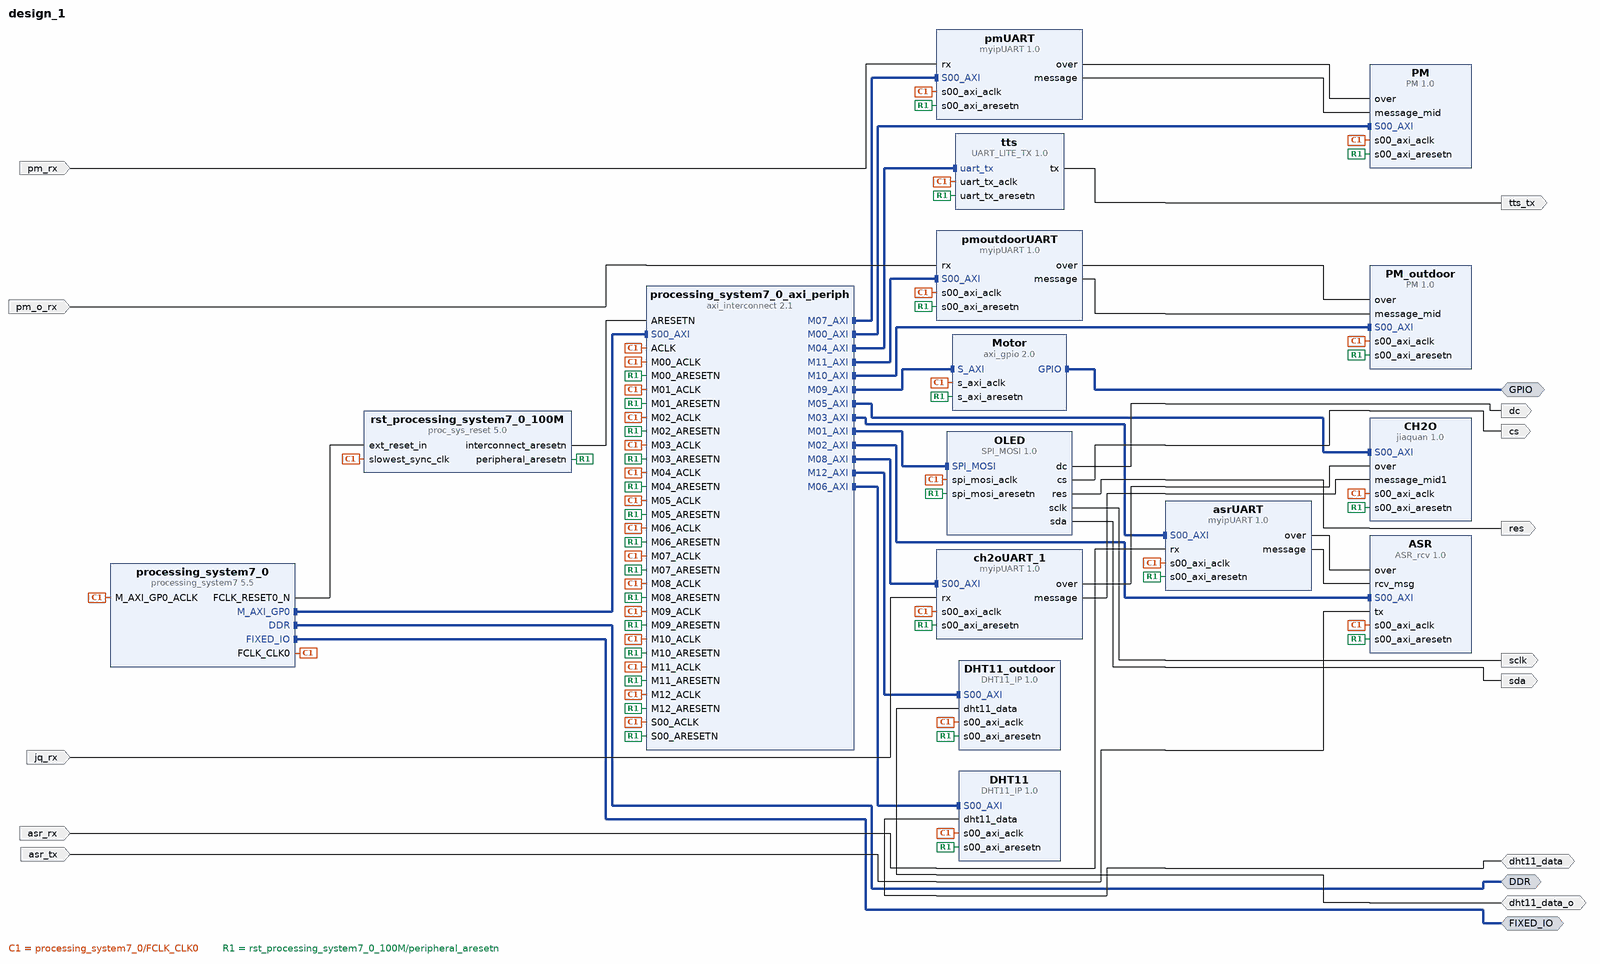
[diagram p0: block diagram of the top level]
# Vivado block design design_1, Vivado 2015.2
create_bd_design design_1

create_bd_intf_port -mode Master -vlnv xilinx.com:interface:ddrx_rtl:1.0 DDR
create_bd_intf_port -mode Master -vlnv xilinx.com:display_processing_system7:fixedio_rtl:1.0 FIXED_IO
create_bd_intf_port -mode Master -vlnv xilinx.com:interface:gpio_rtl:1.0 GPIO
create_bd_port -dir IO dht11_data
create_bd_port -dir I asr_rx
create_bd_port -dir O tts_tx
create_bd_port -dir O dc
create_bd_port -dir O res
create_bd_port -dir O cs
create_bd_port -dir O sclk
create_bd_port -dir O sda
create_bd_port -dir I pm_rx
create_bd_port -dir I jq_rx
create_bd_port -dir I pm_o_rx
create_bd_port -dir IO dht11_data_o
create_bd_port -dir I asr_tx

create_bd_cell -type ip -vlnv xilinx.com:ip:processing_system7:5.5 processing_system7_0
set_property -dict [list \
  CONFIG.PCW_FCLK_CLK0_BUF true \
  CONFIG.PCW_UIPARAM_DDR_FREQ_MHZ 533.333333 \
  CONFIG.PCW_APU_PERIPHERAL_FREQMHZ 666.666666 \
  CONFIG.PCW_SDIO_PERIPHERAL_FREQMHZ 100 \
  CONFIG.PCW_UART_PERIPHERAL_FREQMHZ 100 \
  CONFIG.PCW_FPGA0_PERIPHERAL_FREQMHZ 100 \
  CONFIG.PCW_FPGA1_PERIPHERAL_FREQMHZ 50 \
  CONFIG.PCW_M_AXI_GP0_FREQMHZ 100 \
  CONFIG.PCW_PERIPHERAL_BOARD_PRESET None \
  CONFIG.PCW_PRESET_BANK1_VOLTAGE {LVCMOS 1.8V} \
  CONFIG.PCW_UIPARAM_DDR_PARTNO {MT41K128M16 JT-125} \
  CONFIG.PCW_QSPI_PERIPHERAL_ENABLE 1 \
  CONFIG.PCW_QSPI_QSPI_IO {MIO 1 .. 6} \
  CONFIG.PCW_QSPI_GRP_SINGLE_SS_ENABLE 1 \
  CONFIG.PCW_QSPI_GRP_SINGLE_SS_IO {MIO 1 .. 6} \
  CONFIG.PCW_ENET0_PERIPHERAL_ENABLE 1 \
  CONFIG.PCW_ENET0_ENET0_IO {MIO 16 .. 27} \
  CONFIG.PCW_ENET0_GRP_MDIO_ENABLE 1 \
  CONFIG.PCW_ENET0_GRP_MDIO_IO {MIO 52 .. 53} \
  CONFIG.PCW_ENET_RESET_ENABLE 1 \
  CONFIG.PCW_ENET_RESET_SELECT {Share reset pin} \
  CONFIG.PCW_ENET0_RESET_ENABLE 0 \
  CONFIG.PCW_SD0_PERIPHERAL_ENABLE 1 \
  CONFIG.PCW_SD0_SD0_IO {MIO 40 .. 45} \
  CONFIG.PCW_SD0_GRP_CD_ENABLE 1 \
  CONFIG.PCW_SD0_GRP_CD_IO {MIO 47} \
  CONFIG.PCW_SD0_GRP_WP_ENABLE 1 \
  CONFIG.PCW_SD0_GRP_WP_IO {MIO 46} \
  CONFIG.PCW_UART1_PERIPHERAL_ENABLE 1 \
  CONFIG.PCW_UART1_UART1_IO {MIO 48 .. 49} \
  CONFIG.PCW_TTC0_PERIPHERAL_ENABLE 1 \
  CONFIG.PCW_TTC0_TTC0_IO EMIO \
  CONFIG.PCW_USB0_PERIPHERAL_ENABLE 1 \
  CONFIG.PCW_USB0_USB0_IO {MIO 28 .. 39} \
  CONFIG.PCW_USB_RESET_ENABLE 1 \
  CONFIG.PCW_USB_RESET_SELECT {Share reset pin} \
  CONFIG.PCW_USB0_RESET_ENABLE 0 \
  CONFIG.PCW_I2C_RESET_ENABLE 1 \
  CONFIG.PCW_GPIO_MIO_GPIO_ENABLE 1 \
  CONFIG.PCW_GPIO_MIO_GPIO_IO MIO \
] [get_bd_cells processing_system7_0]
# 501 more settings of processing_system7_0 are not shown: defaults, MIO pin electricals, DDR timing, and values the tool derives
create_bd_cell -type ip -vlnv xilinx.com:user:PM:1.0 PM
create_bd_cell -type ip -vlnv xilinx.com:user:SPI_MOSI:1.0 OLED
create_bd_cell -type ip -vlnv xilinx.com:user:myipUART:1.0 asrUART
create_bd_cell -type ip -vlnv xilinx.com:user:UART_LITE_TX:1.0 tts
create_bd_cell -type ip -vlnv xilinx.com:user:jiaquan:1.0 CH2O
create_bd_cell -type ip -vlnv xilinx.com:user:DHT11_IP:1.0 DHT11
create_bd_cell -type ip -vlnv xilinx.com:ip:axi_interconnect:2.1 processing_system7_0_axi_periph
set_property -dict {CONFIG.NUM_MI 13} [get_bd_cells processing_system7_0_axi_periph]
create_bd_cell -type ip -vlnv xilinx.com:ip:proc_sys_reset:5.0 rst_processing_system7_0_100M
create_bd_cell -type ip -vlnv xilinx.com:user:myipUART:1.0 pmUART
create_bd_cell -type ip -vlnv xilinx.com:user:myipUART:1.0 ch2oUART_1
create_bd_cell -type ip -vlnv xilinx.com:ip:axi_gpio:2.0 Motor
set_property -dict {CONFIG.C_GPIO_WIDTH 1 CONFIG.C_ALL_OUTPUTS 1} [get_bd_cells Motor]
create_bd_cell -type ip -vlnv xilinx.com:user:PM:1.0 PM_outdoor
create_bd_cell -type ip -vlnv xilinx.com:user:myipUART:1.0 pmoutdoorUART
create_bd_cell -type ip -vlnv xilinx.com:user:DHT11_IP:1.0 DHT11_outdoor
create_bd_cell -type ip -vlnv xilinx.com:user:ASR_rcv:1.0 ASR

# ---- connections ----

connect_bd_intf_net [get_bd_intf_pins processing_system7_0/M_AXI_GP0] [get_bd_intf_pins processing_system7_0_axi_periph/S00_AXI]
connect_bd_intf_net [get_bd_intf_pins processing_system7_0_axi_periph/M00_AXI] [get_bd_intf_pins PM/S00_AXI]
connect_bd_intf_net [get_bd_intf_pins processing_system7_0_axi_periph/M01_AXI] [get_bd_intf_pins OLED/SPI_MOSI]
connect_bd_intf_net [get_bd_intf_pins processing_system7_0_axi_periph/M03_AXI] [get_bd_intf_pins asrUART/S00_AXI]
connect_bd_intf_net [get_bd_intf_pins processing_system7_0_axi_periph/M04_AXI] [get_bd_intf_pins tts/uart_tx]
connect_bd_intf_net [get_bd_intf_pins processing_system7_0_axi_periph/M05_AXI] [get_bd_intf_pins CH2O/S00_AXI]
connect_bd_intf_net [get_bd_intf_pins processing_system7_0_axi_periph/M06_AXI] [get_bd_intf_pins DHT11/S00_AXI]
connect_bd_intf_net [get_bd_intf_pins processing_system7_0_axi_periph/M07_AXI] [get_bd_intf_pins pmUART/S00_AXI]
connect_bd_intf_net [get_bd_intf_pins processing_system7_0_axi_periph/M08_AXI] [get_bd_intf_pins ch2oUART_1/S00_AXI]
connect_bd_intf_net [get_bd_intf_pins processing_system7_0_axi_periph/M09_AXI] [get_bd_intf_pins Motor/S_AXI]
connect_bd_intf_net [get_bd_intf_pins processing_system7_0_axi_periph/M10_AXI] [get_bd_intf_pins PM_outdoor/S00_AXI]
connect_bd_intf_net [get_bd_intf_pins processing_system7_0_axi_periph/M11_AXI] [get_bd_intf_pins pmoutdoorUART/S00_AXI]
connect_bd_intf_net [get_bd_intf_pins processing_system7_0_axi_periph/M12_AXI] [get_bd_intf_pins DHT11_outdoor/S00_AXI]
connect_bd_intf_net [get_bd_intf_pins processing_system7_0_axi_periph/M02_AXI] [get_bd_intf_pins ASR/S00_AXI]
connect_bd_intf_net [get_bd_intf_ports DDR] [get_bd_intf_pins processing_system7_0/DDR]
connect_bd_intf_net [get_bd_intf_ports FIXED_IO] [get_bd_intf_pins processing_system7_0/FIXED_IO]
connect_bd_intf_net -intf_net axi_gpio_0_GPIO [get_bd_intf_ports GPIO] [get_bd_intf_pins Motor/GPIO]
connect_bd_net [get_bd_ports dht11_data] [get_bd_pins DHT11/dht11_data]
connect_bd_net -net rx_3 [get_bd_ports asr_rx] [get_bd_pins asrUART/rx]
connect_bd_net -net UART_LITE_TX_0_tx [get_bd_pins tts/tx] [get_bd_ports tts_tx]
connect_bd_net -net SPI_MOSI_0_dc [get_bd_pins OLED/dc] [get_bd_ports dc]
connect_bd_net -net SPI_MOSI_0_res [get_bd_pins OLED/res] [get_bd_ports res]
connect_bd_net -net SPI_MOSI_0_cs [get_bd_pins OLED/cs] [get_bd_ports cs]
connect_bd_net -net SPI_MOSI_0_sclk [get_bd_pins OLED/sclk] [get_bd_ports sclk]
connect_bd_net -net SPI_MOSI_0_sda [get_bd_pins OLED/sda] [get_bd_ports sda]
connect_bd_net [get_bd_pins processing_system7_0/FCLK_CLK0] \
  [get_bd_pins processing_system7_0/M_AXI_GP0_ACLK] [get_bd_pins rst_processing_system7_0_100M/slowest_sync_clk] \
  [get_bd_pins PM/s00_axi_aclk] [get_bd_pins OLED/spi_mosi_aclk] [get_bd_pins asrUART/s00_axi_aclk] \
  [get_bd_pins tts/uart_tx_aclk] [get_bd_pins CH2O/s00_axi_aclk] [get_bd_pins DHT11/s00_axi_aclk] \
  [get_bd_pins pmUART/s00_axi_aclk] [get_bd_pins ch2oUART_1/s00_axi_aclk] [get_bd_pins Motor/s_axi_aclk] \
  [get_bd_pins PM_outdoor/s00_axi_aclk] [get_bd_pins pmoutdoorUART/s00_axi_aclk] [get_bd_pins DHT11_outdoor/s00_axi_aclk] \
  [get_bd_pins ASR/s00_axi_aclk] [get_bd_pins processing_system7_0_axi_periph/S00_ACLK] \
  [get_bd_pins processing_system7_0_axi_periph/ACLK] [get_bd_pins processing_system7_0_axi_periph/M00_ACLK] \
  [get_bd_pins processing_system7_0_axi_periph/M01_ACLK] [get_bd_pins processing_system7_0_axi_periph/M02_ACLK] \
  [get_bd_pins processing_system7_0_axi_periph/M03_ACLK] [get_bd_pins processing_system7_0_axi_periph/M04_ACLK] \
  [get_bd_pins processing_system7_0_axi_periph/M05_ACLK] [get_bd_pins processing_system7_0_axi_periph/M06_ACLK] \
  [get_bd_pins processing_system7_0_axi_periph/M07_ACLK] [get_bd_pins processing_system7_0_axi_periph/M08_ACLK] \
  [get_bd_pins processing_system7_0_axi_periph/M09_ACLK] [get_bd_pins processing_system7_0_axi_periph/M10_ACLK] \
  [get_bd_pins processing_system7_0_axi_periph/M11_ACLK] [get_bd_pins processing_system7_0_axi_periph/M12_ACLK]
connect_bd_net [get_bd_pins processing_system7_0/FCLK_RESET0_N] [get_bd_pins rst_processing_system7_0_100M/ext_reset_in]
connect_bd_net [get_bd_pins rst_processing_system7_0_100M/peripheral_aresetn] \
  [get_bd_pins PM/s00_axi_aresetn] [get_bd_pins OLED/spi_mosi_aresetn] [get_bd_pins asrUART/s00_axi_aresetn] \
  [get_bd_pins tts/uart_tx_aresetn] [get_bd_pins CH2O/s00_axi_aresetn] [get_bd_pins DHT11/s00_axi_aresetn] \
  [get_bd_pins pmUART/s00_axi_aresetn] [get_bd_pins ch2oUART_1/s00_axi_aresetn] [get_bd_pins Motor/s_axi_aresetn] \
  [get_bd_pins PM_outdoor/s00_axi_aresetn] [get_bd_pins pmoutdoorUART/s00_axi_aresetn] \
  [get_bd_pins DHT11_outdoor/s00_axi_aresetn] [get_bd_pins ASR/s00_axi_aresetn] \
  [get_bd_pins processing_system7_0_axi_periph/S00_ARESETN] [get_bd_pins processing_system7_0_axi_periph/M00_ARESETN] \
  [get_bd_pins processing_system7_0_axi_periph/M01_ARESETN] [get_bd_pins processing_system7_0_axi_periph/M02_ARESETN] \
  [get_bd_pins processing_system7_0_axi_periph/M03_ARESETN] [get_bd_pins processing_system7_0_axi_periph/M04_ARESETN] \
  [get_bd_pins processing_system7_0_axi_periph/M05_ARESETN] [get_bd_pins processing_system7_0_axi_periph/M06_ARESETN] \
  [get_bd_pins processing_system7_0_axi_periph/M07_ARESETN] [get_bd_pins processing_system7_0_axi_periph/M08_ARESETN] \
  [get_bd_pins processing_system7_0_axi_periph/M09_ARESETN] [get_bd_pins processing_system7_0_axi_periph/M10_ARESETN] \
  [get_bd_pins processing_system7_0_axi_periph/M11_ARESETN] [get_bd_pins processing_system7_0_axi_periph/M12_ARESETN]
connect_bd_net [get_bd_pins rst_processing_system7_0_100M/interconnect_aresetn] [get_bd_pins processing_system7_0_axi_periph/ARESETN]
connect_bd_net -net myipUART_0_over [get_bd_pins pmUART/over] [get_bd_pins PM/over]
connect_bd_net -net myipUART_0_message [get_bd_pins pmUART/message] [get_bd_pins PM/message_mid]
connect_bd_net -net rx_1 [get_bd_ports pm_rx] [get_bd_pins pmUART/rx]
connect_bd_net -net myipUART_1_over [get_bd_pins ch2oUART_1/over] [get_bd_pins CH2O/over]
connect_bd_net -net myipUART_1_message [get_bd_pins ch2oUART_1/message] [get_bd_pins CH2O/message_mid1]
connect_bd_net -net rx_2 [get_bd_ports jq_rx] [get_bd_pins ch2oUART_1/rx]
connect_bd_net -net myipUART_0_over1 [get_bd_pins pmoutdoorUART/over] [get_bd_pins PM_outdoor/over]
connect_bd_net -net myipUART_0_message1 [get_bd_pins pmoutdoorUART/message] [get_bd_pins PM_outdoor/message_mid]
connect_bd_net -net rx_4 [get_bd_ports pm_o_rx] [get_bd_pins pmoutdoorUART/rx]
connect_bd_net [get_bd_ports dht11_data_o] [get_bd_pins DHT11_outdoor/dht11_data]
connect_bd_net [get_bd_ports asr_tx] [get_bd_pins ASR/tx]
connect_bd_net [get_bd_pins asrUART/over] [get_bd_pins ASR/over]
connect_bd_net [get_bd_pins asrUART/message] [get_bd_pins ASR/rcv_msg]

# ---- address map ----
assign_bd_address -offset 0x41200000 -range 64K -target_address_space [get_bd_addr_spaces processing_system7_0/Data] [get_bd_addr_segs Motor/S_AXI/Reg]
assign_bd_address -offset 0x43C00000 -range 64K -target_address_space [get_bd_addr_spaces processing_system7_0/Data] [get_bd_addr_segs PM/S00_AXI/S00_AXI_reg]
assign_bd_address -offset 0x43C10000 -range 64K -target_address_space [get_bd_addr_spaces processing_system7_0/Data] [get_bd_addr_segs OLED/SPI_MOSI/SPI_MOSI_reg]
assign_bd_address -offset 0x43C20000 -range 64K -target_address_space [get_bd_addr_spaces processing_system7_0/Data] [get_bd_addr_segs ASR/S00_AXI/S00_AXI_reg]
assign_bd_address -offset 0x43C30000 -range 64K -target_address_space [get_bd_addr_spaces processing_system7_0/Data] [get_bd_addr_segs asrUART/S00_AXI/S00_AXI_reg]
assign_bd_address -offset 0x43C40000 -range 64K -target_address_space [get_bd_addr_spaces processing_system7_0/Data] [get_bd_addr_segs tts/uart_tx/uart_tx_reg]
assign_bd_address -offset 0x43C50000 -range 64K -target_address_space [get_bd_addr_spaces processing_system7_0/Data] [get_bd_addr_segs CH2O/S00_AXI/S00_AXI_reg]
assign_bd_address -offset 0x43C60000 -range 64K -target_address_space [get_bd_addr_spaces processing_system7_0/Data] [get_bd_addr_segs DHT11/S00_AXI/S00_AXI_reg]
assign_bd_address -offset 0x43C70000 -range 64K -target_address_space [get_bd_addr_spaces processing_system7_0/Data] [get_bd_addr_segs pmUART/S00_AXI/S00_AXI_reg]
assign_bd_address -offset 0x43C80000 -range 64K -target_address_space [get_bd_addr_spaces processing_system7_0/Data] [get_bd_addr_segs ch2oUART_1/S00_AXI/S00_AXI_reg]
assign_bd_address -offset 0x43C90000 -range 64K -target_address_space [get_bd_addr_spaces processing_system7_0/Data] [get_bd_addr_segs PM_outdoor/S00_AXI/S00_AXI_reg]
assign_bd_address -offset 0x43CA0000 -range 64K -target_address_space [get_bd_addr_spaces processing_system7_0/Data] [get_bd_addr_segs pmoutdoorUART/S00_AXI/S00_AXI_reg]
assign_bd_address -offset 0x43CB0000 -range 64K -target_address_space [get_bd_addr_spaces processing_system7_0/Data] [get_bd_addr_segs DHT11_outdoor/S00_AXI/S00_AXI_reg]

validate_bd_design
save_bd_design
